# EAGLE design FET sense drive (EAGLE 7.1.0)
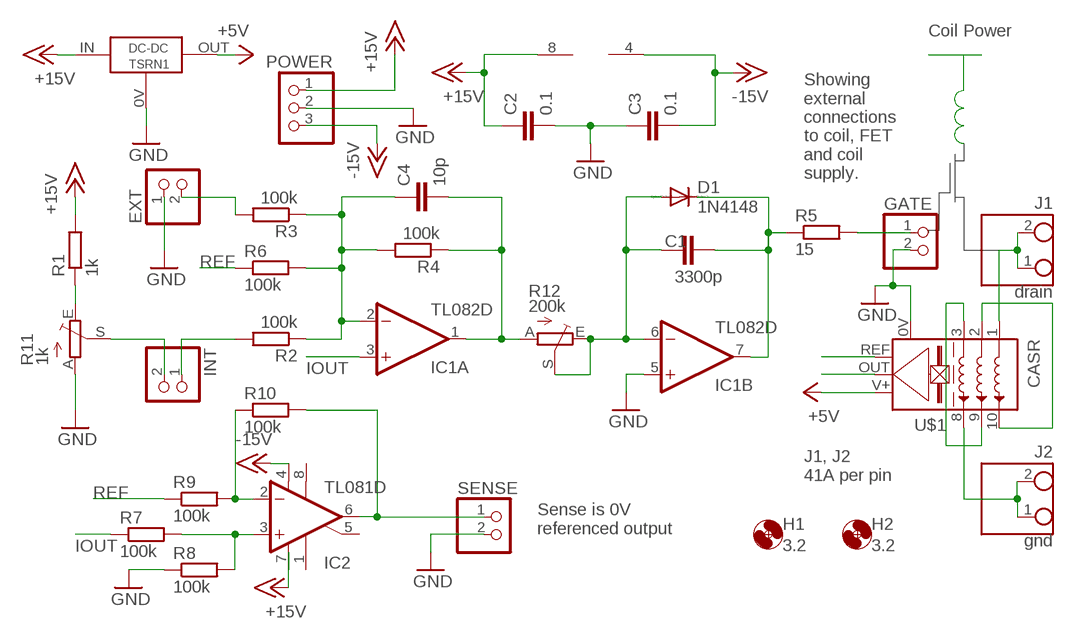
[diagram p0: schematic, sheet 1]

## Parts
C1  3300p  C-EU025-025X050  [C025-025X050]
C2  0.1  C-EUC0805  [C0805]
C3  0.1  C-EUC0805  [C0805]
C4  10p  C-EU025-025X050  [C025-025X050]
D1  1N4148  [SOD323_ST]
DC-DC  TSRN1  [TSRN1X]
EXT  PINHD-1X2  [1X02]
GATE  PINHD-1X2  [1X02]
H1  3.2  MOUNT-HOLE3.2  [3,2]
H2  3.2  MOUNT-HOLE3.2  [3,2]
IC1  TL082D  [SO08]
IC2  TL081D  [SO08]
INT  PINHD-1X2  [1X02]
J1  drain  PHL5/2  [PHL]
J2  gnd  PHL5/2  [PHL]
POWER  PINHD-1X3  [1X03]
R1  1k  R-EU_R0805  [R0805]
R2  100k  R-EU_R0805  [R0805]
R3  100k  R-EU_R0805  [R0805]
R4  100k  R-EU_R0805  [R0805]
R5  15  R-EU_0204/5  [0204/5]
R6  100k  R-EU_R0805  [R0805]
R7  100k  R-EU_R0805  [R0805]
R8  100k  R-EU_R0805  [R0805]
R9  100k  R-EU_R0805  [R0805]
R10  100k  R-EU_R0805  [R0805]
R11  1k  TRIM_EU-B25P  [B25P]
R12  200k  TRIM_EU-B25P  [B25P]
SENSE  PINHD-1X2  [1X02]
U$1  CASR  [CASR]

## Nets
+5V: DC-DC.OUT U$1.V+
+15V: C2.1 DC-DC.IN IC1.8(P:V+) POWER.1 R1.2
-15V: C3.2 IC1.4(P:V-) IC2.4(V-) POWER.3
GND: C2.2 C3.1 DC-DC.0V EXT.1 GATE.2 IC1.5(B:+IN) POWER.2 R8.1 R11.A SENSE.2 U$1.0V
IOUT: IC1.3(A:+IN) R7.1 U$1.OUT(VOUT)
N$1: R1.1 R11.E
N$2: INT.2 R11.S
N$3: INT.1 R2.2
N$4: EXT.2 R3.2
N$5: C4.1 IC1.2(A:-IN) R2.1 R3.1 R4.2 R6.2
N$8: J1.1 J1.2 U$1.1(IN1)
N$9: C4.2 IC1.1(A:OUT) R4.1 R12.A
N$10: C1.1 D1.A IC1.6(B:-IN) R12.E R12.S
N$11: C1.2 D1.C IC1.7(B:OUT) R5.1
N$12: GATE.1 R5.2
N$14: IC2.3(+IN) R7.2 R8.2
N$15: U$1.2(IN2) U$1.10(OUT10)
N$16: J2.1 J2.2 U$1.8(OUT8)
N$17: U$1.3(IN3) U$1.9(OUT9)
N$18: IC2.2(-IN) R9.2 R10.1
N$19: IC2.6(OUT) R10.2 SENSE.1
REF: R6.1 R9.1 U$1.REF(VREF)
Unconnected: IC2.1(ON1) IC2.5(ON2) IC2.8(OPT)

## Notes on the sheet
- Coil Power
- Showing
  external
  connections
  to coil, FET 
  and coil 
  supply.
- J1, J2
  41A per pin
- Sense is 0V 
  referenced output

## Power pins joined to a net without a drawn wire
V+: IC2.7(V+)

## Library data of the parts
C1-C4 = rcl:C-EU: CAPACITOR, European symbol
D1 = custom_parts:1N4148: DIODE high speed (Philips)
DC-DC = custom_parts:TSRN1: Traco Power DC-DC converter TSRN 1 series www.tracopower.com
EXT GATE INT SENSE = pinhead:PINHD-1X2: PIN HEADER
H1 H2 = holes:MOUNT-HOLE: MOUNTING HOLE with drill center marker
IC1 = linear:TL082: OP AMP Data sheet <http://www.ti.com/lit/ds/symlink/tl084a . pdf>; DATA_SHEET: <a href="http://www.ti.com/lit/ds/symlink/tl084a.pdf"> Data sheet </a>
IC2 = linear:TL081: OP AMP
J1 J2 = custom_parts:PHL5/2: PHL 5/2 Phoenix Connector 41A Lever action www.phoenixcontact.com
POWER = pinhead:PINHD-1X3: PIN HEADER
R1-R10 = rcl:R-EU_: RESISTOR, European symbol
R11 R12 = pot:TRIM_EU-: POTENTIOMETER
U$1 = custom_parts:CASR: LEM CASR current sensor www.lem.com

## Board
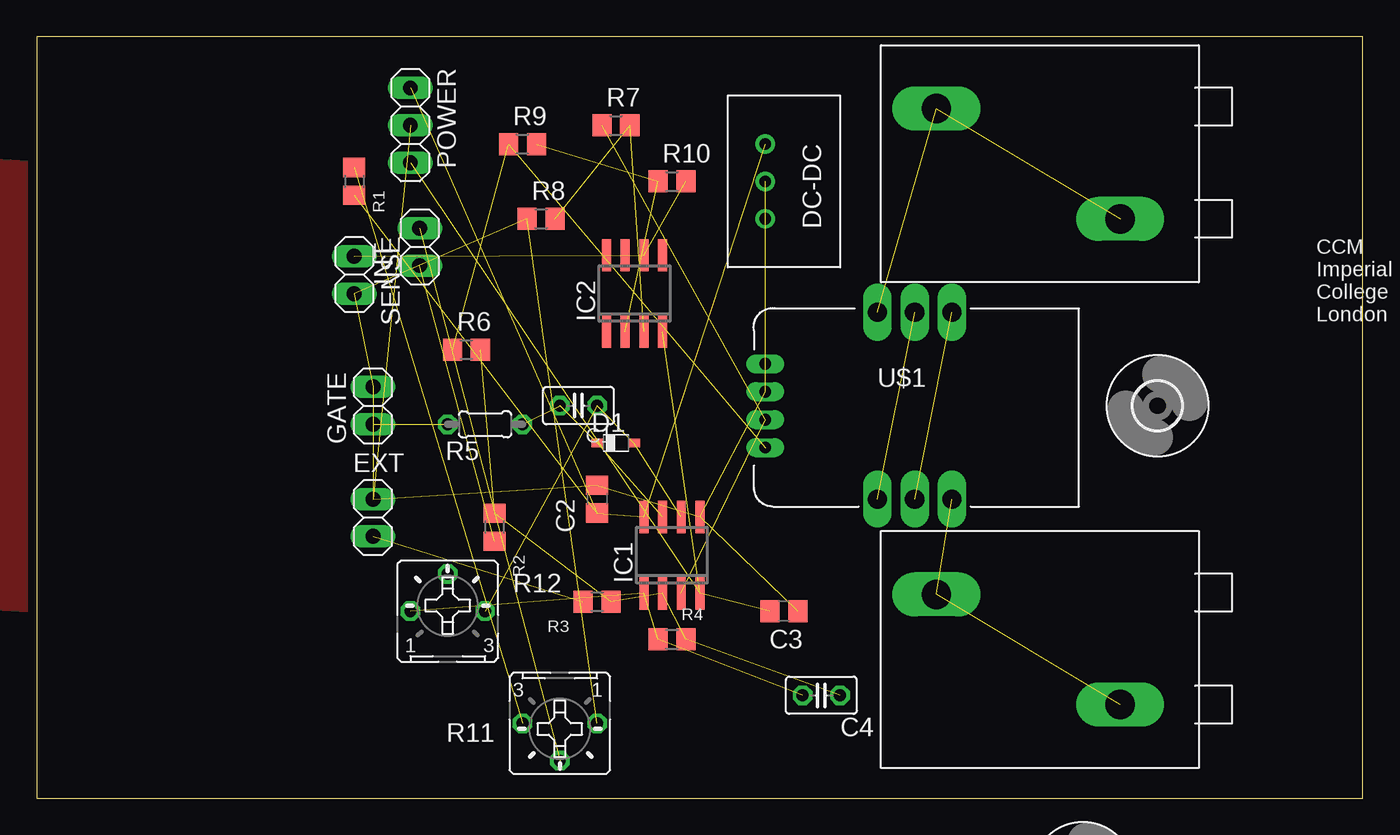
[diagram p1: board, top side]
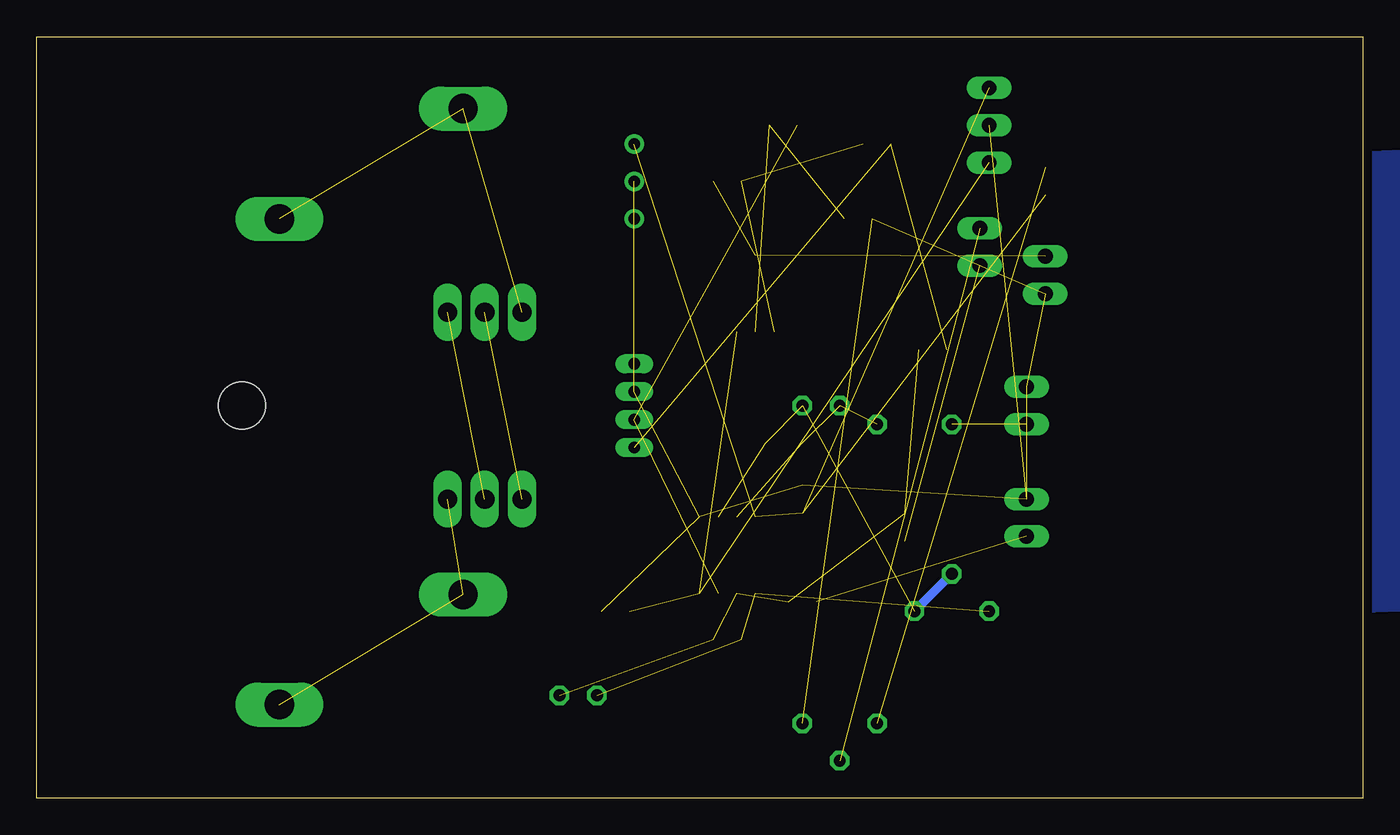
[diagram p2: board, bottom side, seen from below]

Size 90.15 x 51.74 mm. Coordinates in mm from the lower left corner, seen from the top.
Outline: 0,0 90.15,0 90.15,51.74 0,51.74 0,0
Copper layers (1*16): Top 0.035mm / dielectric 1.5mm / Bottom 0.035mm
Design rules "dirt_cheap_dirty_boards.v1": minimum track width 5mil, minimum drill 12mil, track to track 5mil, track to pad 5mil, pad to pad 5mil, via to via 5mil, smd to smd 0mil, copper to edge 10mil, drill to drill 10mil, minimum pad ring 10mil, minimum via ring 6mil, stop-mask expansion 2mil, vias tented up to drill 25mil, thermal gap 10mil

### Footprints (pad centres in the part's own frame; a part is rotated, then mirrored left to right if it is on the bottom)
C025-025X050 = drill 0.813 octagon: 1 -1.27,0; 2 1.27,0
C0805 = smd 1.3 x 1.5: 1 -0.95,0; 2 0.95,0
SOD323_ST = smd 0.8 x 0.6: A 1.25,0; C -1.25,0
TSRN1X = drill 0.8: 0V 0,0; IN -2.54,0; OUT 2.54,0
1X02 = drill 1.016 long: 1 -1.27,0; 2 1.27,0
3,2 = hole 3.2: 0,0
SO08 = smd 0.6 x 2.2: 1 -1.905,-2.6; 2 -0.635,-2.6; 3 0.635,-2.6; 4 1.905,-2.6; 5 1.905,2.6; 6 0.635,2.6; 7 -0.635,2.6; 8 -1.905,2.6
PHL = drill 2 long: 1 0,0; 2 7.493,12.497
1X03 = drill 1.016 long: 1 -2.54,0; 2 0,0; 3 2.54,0
R0805 = smd 1.3 x 1.5: 1 -0.95,0; 2 0.95,0
0204/5 = drill 0.813 octagon: 1 -2.54,0; 2 2.54,0
B25P = drill 0.813 octagon: A -2.54,0; E 2.54,0; S 0,2.54
CASR = drill 0.8 long: 0V -10.16,0.953; OUT -10.16,-0.953; REF -10.16,-2.845; V+ -10.16,2.845 | drill 1.3 long: 1 -2.54,6.35; 2 0,6.35; 3 2.54,6.35; 8 2.54,-6.35; 9 0,-6.35; 10 -2.54,-6.35

### Placement (x,y rotation side)
C1  36.83,26.67 180 top
C2  38.1,20.32 90 top
C3  50.8,12.7 180 top
C4  53.34,6.99 180 top
D1  39.37,24.13 0 top
DC-DC  49.53,41.91 270 top
EXT  22.86,19.05 270 top
GATE  22.86,26.67 90 top
H1  71.12,-5.08 0 top  (outside the outline)
H2  76.2,26.67 0 top
IC1  43.18,16.51 0 top
IC2  40.64,34.29 0 top
INT  26.04,37.47 90 top
J1  73.66,39.37 90 top
J2  73.66,6.35 90 top
POWER  25.4,45.72 270 top
R1  21.59,41.91 270 top
R2  31.11,18.41 270 top
R3  38.1,13.34 180 top
R4  43.18,10.79 0 top
R5  30.48,25.4 180 top
R6  29.21,30.48 0 top
R7  39.37,45.72 0 top
R8  34.29,39.37 0 top
R9  33.02,44.45 0 top
R10  43.18,41.91 0 top
R11  35.56,5.08 180 top
R12  27.94,12.7 0 top
SENSE  21.59,35.56 270 top
U$1  59.69,26.67 0 top

### Tracks (layer width: path | path; a pad name or v marks a point on that pad's centre or on a via)
+5V  (1 unrouted)
+15V  (4 unrouted)
-15V  (3 unrouted)
GND  (10 unrouted)
  pour Top (isolate 0.61): 0,12.7 0,43.18 -21.59,44.45 -21.59,13.97
  pour Bottom (isolate 0.61): 0,12.7 0,43.81 -24.13,45.08 -31.75,13.97
IOUT  (2 unrouted)
N$1  (1 unrouted)
N$2  (1 unrouted)
N$3  (1 unrouted)
N$4  (1 unrouted)
N$5  (5 unrouted)
N$8  (2 unrouted)
N$9  (3 unrouted)
N$10  (3 unrouted)
  Bottom 0.61: R12.S R12.E
N$11  (3 unrouted)
N$12  (1 unrouted)
N$14  (2 unrouted)
N$15  (1 unrouted)
N$16  (2 unrouted)
N$17  (1 unrouted)
N$18  (2 unrouted)
N$19  (2 unrouted)
REF  (2 unrouted)

### Text on the board
tNames: -15V | +15V | CCM / Imperial / College / London | In | Rs | Gate | Out | FET Driver